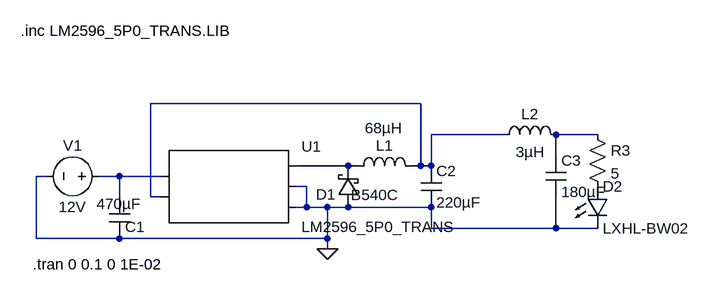
[diagram p0: schematic lm2596_const.asc]
lm2596_const.asc, the LTspice schematic file:
Version 4
SHEET 1 968 680
WIRE 544 32 128 32
WIRE 672 80 560 80
WIRE 816 80 752 80
WIRE 752 112 752 80
WIRE 432 128 352 128
WIRE 448 128 432 128
WIRE 544 128 544 32
WIRE 544 128 528 128
WIRE 560 128 560 80
WIRE 560 128 544 128
WIRE -32 144 -48 144
WIRE 80 144 48 144
WIRE 144 144 80 144
WIRE 368 160 352 160
WIRE 80 176 80 144
WIRE 128 176 128 32
WIRE 144 176 128 176
WIRE 368 192 368 160
WIRE 368 192 352 192
WIRE 400 192 368 192
WIRE 432 192 400 192
WIRE 560 192 432 192
WIRE 560 224 560 192
WIRE 752 224 752 176
WIRE 752 224 560 224
WIRE 816 224 752 224
WIRE -48 240 -48 144
WIRE 80 240 -48 240
WIRE 400 240 400 192
WIRE 400 240 80 240
WIRE 400 256 400 240
FLAG 400 256 0
SYMBOL voltage 64 144 R90
WINDOW 0 -32 56 VBottom 2
WINDOW 3 32 56 VTop 2
WINDOW 123 0 0 Left 0
WINDOW 39 0 0 Left 0
SYMATTR InstName V1
SYMATTR Value 12V
SYMBOL cap 64 176 R0
WINDOW 0 25 46 Left 2
WINDOW 3 -19 11 Left 2
SYMATTR InstName C1
SYMATTR Value 470µF
SYMATTR SpiceLine V=50V
SYMBOL cap 544 128 R0
SYMATTR InstName C2
SYMATTR Value 220µF
SYMATTR SpiceLine V=35V
SYMBOL ind 432 144 R270
WINDOW 0 32 56 VTop 2
WINDOW 3 90 55 VBottom 2
SYMATTR InstName L1
SYMATTR Value 68µH
SYMBOL schottky 448 192 R180
WINDOW 0 35 20 Left 2
WINDOW 3 -62 19 Left 2
SYMATTR InstName D1
SYMATTR Value B540C
SYMBOL LED 800 160 R0
SYMATTR InstName D2
SYMATTR Value LXHL-BW02
SYMBOL res 800 64 R0
SYMATTR InstName R3
SYMATTR Value 5
SYMATTR SpiceLine tol=1 pwr=2
SYMBOL AutoGenerated\\LM2596_5P0_TRANS 240 160 R0
SYMATTR InstName U1
SYMBOL cap 736 112 R0
SYMATTR InstName C3
SYMATTR Value 180µF
SYMBOL ind 656 96 R270
WINDOW 0 32 56 VTop 2
WINDOW 3 5 56 VBottom 2
SYMATTR InstName L2
SYMATTR Value 3µH
TEXT -54 280 Left 2 !.tran 0 0.1 0 1E-02
TEXT -72 -80 Left 2 !.inc LM2596_5P0_TRANS.LIB

The netlist it stands for:
* lm2596_const.asc
V1 N004 0 12V
C1 N004 0 470µF V=50V
C2 N001 0 220µF V=35V
L1 N003 N001 68µH
D1 0 N003 B540C
D2 P001 0 LXHL-BW02
R3 N002 P001 5 tol=1 pwr=2
* U1: LM2596_5P0_TRANS (symbol AutoGenerated\LM2596_5P0_TRANS not available, pins judged from their places): pin1=N004 pin2=N001 pin3=N003 pin4=0 pin5=0
C3 N002 0 180µF
L2 N001 N002 3µH
.model D D
.lib standard.dio
.tran 0 0.1 0 1E-02
.inc LM2596_5P0_TRANS.LIB
.backanno
.end